# Altium schematic sheet Sheet_3.3v_2020-09-13_15-20-00.schdoc
size 351 x 253 mm
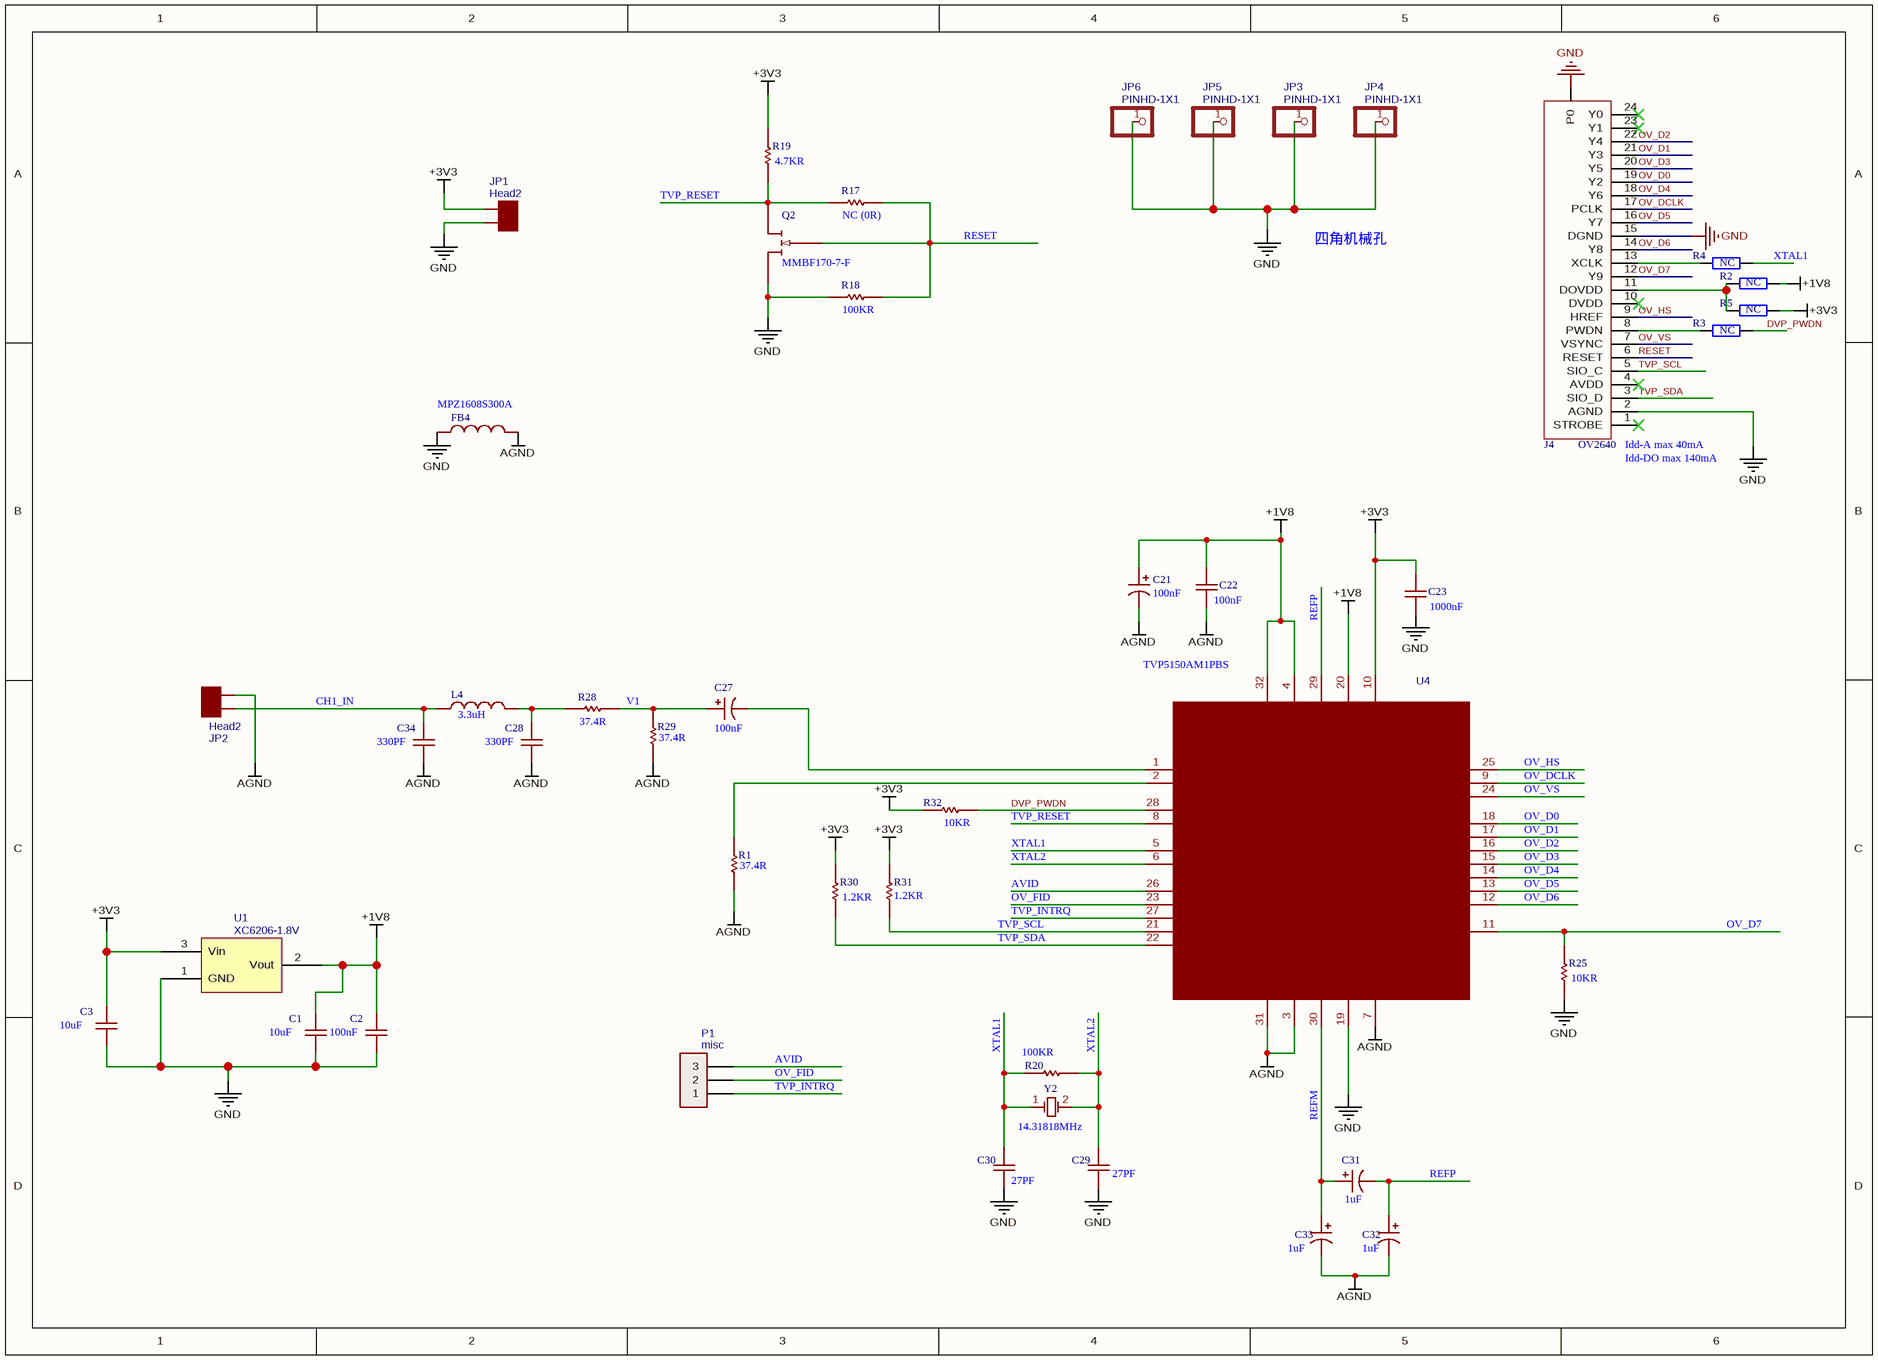
[diagram p0: Sheet_3.3v_2020-09-13_15-20-00.schdoc]

## Parts
C1  10uF  [C0805]  (value not drawn)
C2  330PF  [C0603]  (value not drawn)
C3  330PF  [C0805]  (value not drawn)
C21  100nF  [C0603]  (value not drawn)
C22  100nF  [C0603]  (value not drawn)
C23  1000nF  [C0603]  (value not drawn)
C27  100nF  [C0603]  (value not drawn)
C28  330PF  [C0603]  (value not drawn)
C29  27PF  [C0603]  (value not drawn)
C30  27PF  [C0603]  (value not drawn)
C31  1uF  [C0603]  (value not drawn)
C32  1uF  [C0603]  (value not drawn)
C33  1uF  [C0603]  (value not drawn)
C34  330PF  [C0603]  (value not drawn)
FB4  MPZ1608S300A  [L0805]  (value not drawn)
J4  OV2640  [FFC/SM0.5-2H24-OV5640]
JP1  Head2  [HEAD2]
JP2  Head2  [HEAD2]
JP3  PINHD-1X1  [HOLE]
JP4  PINHD-1X1  [HOLE]
JP5  PINHD-1X1  [HOLE]
JP6  PINHD-1X1  [HOLE]
L4  3.3uH  [L0805]  (value not drawn)
P1  misc  [1X3 PIN HEADER 2.54MM]
Q2  MMBF170-7-F  [SOT-23-3]  (value not drawn)
R1  37.4R  [R0603]  (value not drawn)
R2  NC  [R0603]
R3  NC  [R0603]
R4  NC  [R0603]
R5  NC  [R0603]
R17  NC (0R)  [R0603]  (value not drawn)
R18  100KR  [R0603]  (value not drawn)
R19  4.7KR  [R0603]  (value not drawn)
R20  100KR  [R0603]  (value not drawn)
R25  10KR  [R0603]  (value not drawn)
R28  37.4R  [R0603]  (value not drawn)
R29  37.4R  [R0603]  (value not drawn)
R30  1.2KR  [R0603]  (value not drawn)
R31  1.2KR  [R0603]  (value not drawn)
R32  10KR  [R0603]  (value not drawn)
U1  XC6206-1.8V  [SOT-23-3]
U4  TVP5150  [PBS32]  (value not drawn)
Y2  14.31818MHz  [晶振]  (value not drawn)

## Nets
+1V8: C1.2 C2.2 C21.1 C22.1 R2.2 U1.2(Vout) U4.4(PLL_AVDD) U4.20(DVDD) U4.32(CH_AVDD)
+3V3: C3.2 C23.1 JP1.1 R5.2 R19.1 R30.1 R31.1 R32.2 U1.3(Vin) U4.10(IO_DVDD)
AGND: C21.2 C22.2 C28.1 C32.2 C33.2 C34.1 FB4.2 JP2.1 R1.2 R29.2 U4.3(PLL_AGND) U4.7(AGND) U4.31(CH_AGND)
GND: C1.1 C2.1 C3.1 C23.2 C29.1 C30.1 FB4.1 J4.2(AGND) J4.15(DGND) J4.P0 JP1.2 JP3.1 JP4.1 JP5.1 JP6.1 Q2.2(S) R18.1 R25.2 U1.1(GND) U4.19(DGND)
AVID: P1.3 U4.26(AVID)
CH1_IN: C34.2 JP2.2 L4.1
DVP_PWDN: R3.2 R32.1 U4.28(PDN)
OV_D0: J4.19(Y2) U4.18(YOUT0)
OV_D1: J4.21(Y3) U4.17(YOUT1)
OV_D2: J4.22(Y4) U4.16(YOUT2)
OV_D3: J4.20(Y5) U4.15(YOUT3)
OV_D4: J4.18(Y6) U4.14(YOUT4)
OV_D5: J4.16(Y7) U4.13(YOUT5)
OV_D6: J4.14(Y8) U4.12(YOUT6)
OV_D7: J4.12(Y9) R25.1 U4.11(YOUT7/I2CSEL)
OV_DCLK: J4.17(PCLK) U4.9(PCLK/SCLK)
OV_FID: P1.2 U4.23(FID/GLCO)
OV_HS: J4.9(HREF) U4.25(HSYNC)
OV_VS: J4.7(VSYNC) U4.24(VSYNC/PALI)
REFM: C31.1 C33.1 U4.30(REFM)
REFP: C31.2 C32.1 U4.29(REFP)
RESET: J4.6(RESET) Q2.1(G) R17.2 R18.2
TVP_INTRQ: P1.1 U4.27(INTREQ/GPCL/VBLK)
TVP_RESET: Q2.3(D) R17.1 R19.2 U4.8(RESETB)
TVP_SCL: J4.5(SIO_C) R31.2 U4.21(SCL)
TVP_SDA: J4.3(SIO_D) R30.2 U4.22(SDA)
V1: C27.1 R28.2 R29.1
XTAL1: C30.2 R4.2 R20.2 U4.5(XTAL1/OSC) Y2.1(OSC1)
XTAL2: C29.2 R20.1 U4.6(XTAL2) Y2.2(OSC2)
NetC27_2: C27.2 U4.1(AIP1A)
NetC28_2: C28.2 L4.2 R28.1
NetJ4_8: J4.8(PWDN) R3.1
NetJ4_11: J4.11(DOVDD) R2.1 R5.1
NetJ4_13: J4.13(XCLK) R4.1
NetR1_1: R1.1 U4.2(AIP1B)

Not connected (* = marked no-connect by the designer): J4 1(STROBE)* 4(AVDD)* 10(DVDD)* 23(Y1)* 24(Y0)*

## Notes on the sheet
- 四角机械孔
- (near J4) Idd-DO max 140mA
- (near J4) Idd-A max 40mA
- (in symbol 330PF) 100nF; 10uF

## Library data of the parts
C1 = 10uF: PartNumber: 330PF; Current Footprint: 0805 (2012 Metric); Package Display: No; Published: 8-Jun-2000; LatestRevisionDate: 17-Jul-2002; LatestRevisionNote: Re-released for DXP Platform.; PackageReference: RAD-0.3; Publisher: Altium Limited; Part Number: 330PF
C2 C3 C28 C34 = 330PF: Current Footprint: 0805 (2012 Metric); Published: 8-Jun-2000; LatestRevisionDate: 17-Jul-2002; LatestRevisionNote: Re-released for DXP Platform.; PackageReference: RAD-0.3; Publisher: Altium Limited; PartNumber: 330PF; Part Number: 330PF
C21 C27 = 100nF: Manufacturer: Vishay or AVX Corporation; Current Footprint: 1206 (3216 Metric); Assembly Status: A; Published: 8-Jun-2000; LatestRevisionDate: 17-Jul-2002; LatestRevisionNote: Re-released for DXP Platform.; PackageReference: RB7.6-15; Publisher: Altium Limited; PartNumber: 100nF; Part Number: 100nF
C22 = 100nF: Current Footprint: 0805 (2012 Metric); Published: 8-Jun-2000; LatestRevisionDate: 17-Jul-2002; LatestRevisionNote: Re-released for DXP Platform.; PackageReference: RAD-0.3; Publisher: Altium Limited; PartNumber: 100nF; Part Number: 100nF
C23 = 1000nF: Current Footprint: 0805 (2012 Metric); Published: 8-Jun-2000; LatestRevisionDate: 17-Jul-2002; LatestRevisionNote: Re-released for DXP Platform.; PackageReference: RAD-0.3; Publisher: Altium Limited; PartNumber: 1000nF; Part Number: 1000nF
C29 C30 = 27PF: Current Footprint: 0805 (2012 Metric); Published: 8-Jun-2000; LatestRevisionDate: 17-Jul-2002; LatestRevisionNote: Re-released for DXP Platform.; PackageReference: RAD-0.3; Publisher: Altium Limited; PartNumber: 27PF; Part Number: 27PF
C31 = 1uF: Manufacturer: Vishay or AVX Corporation; Current Footprint: 1206 (3216 Metric); Assembly Status: A; Package Display: No; Published: 8-Jun-2000; LatestRevisionDate: 17-Jul-2002; LatestRevisionNote: Re-released for DXP Platform.; PackageReference: RB7.6-15; Publisher: Altium Limited; PartNumber: 1uF; Part Number: 1uF
C32 C33 = 1uF: Manufacturer: Vishay or AVX Corporation; Current Footprint: 1206 (3216 Metric); Assembly Status: A; Published: 8-Jun-2000; LatestRevisionDate: 17-Jul-2002; LatestRevisionNote: Re-released for DXP Platform.; PackageReference: RB7.6-15; Publisher: Altium Limited; PartNumber: 1uF; Part Number: 1uF
FB4 = MPZ1608S300A: Manufacturer Part Number: MPZ1608S300ATAH0; Code_IEC: 1005; Current Footprint: 0805 (2012 Metric); Assembly Status: A; Description: FERRITE BEAD 30 OHM 0603 1LN; Filter Type: Power Line; Number of Lines: 1; Impedance @ Frequency: 30 Ohm @ 100MHz; Current Rating (Max): 5A; DC Resistance (DCR) (Max): 10 mOhm; Published: 8-Jun-2000; LatestRevisionDate: 17-Jul-2002; LatestRevisionNote: Re-released for DXP Platform.; PackageReference: 0402-A; Publisher: Altium Limited; Code_JEITA: 0402; Manufacturer: *; PartNumber: MPZ1608S300A; Supplier 1: Digi-Key; Supplier Part Number 1: 445-1562-2-ND; RoHS: RoHS Compliant; Category: Filters; Stock 1: 76000; Pricing 1: 4000=0.0208, 8000=0.01885, 12000=0.0182, 28000=0.0169, 100000=0.01671 (USD); Packaging: Tape & Reel (TR); Part Status: Active; Ratings: -; Operating Temperature: -55�C  125�C; Package / Case: 0603 (1608 Metric); Mounting Type: Surface Mount; Height (Max): 0.030" (0.75mm); Size / Dimension: 0.063" L x 0.031" W (1.60mm x 0.80mm); ComponentLink1URL: https://product.tdk.com/info/en/catalog/datasheets/beads_commercial_power_mpz1608_en.pdf; ComponentLink1Description: https://product.tdk.com/info/en/catalog/datasheets/beads_commercial_power_mpz1608_en.pdf; Part Number: MPZ1608S300A
JP1 JP2 = Head2: Contributor: 395253A; spicePre: J; spiceSymbolName: Head2
JP3-JP6 = PINHD-1X1: Contributor: Adafruit; spicePre: J; spiceSymbolName: PINHD-1X1
L4 = 3.3uH: Code_IEC: 1005; Current Footprint: 0805 (2012 Metric); Assembly Status: A; Published: 8-Jun-2000; LatestRevisionDate: 17-Jul-2002; LatestRevisionNote: Re-released for DXP Platform.; PackageReference: 0402-A; Publisher: Altium Limited; Code_JEITA: 0402; Manufacturer: *; PartNumber: 3.3uH; Part Number: 3.3uH
P1 = misc: BOM_Manufacturer Part: Female header/2.54mm2x3 Female header; spicePre: P; spiceSymbolName: Header-Female-2.54_1x3
Q2 = MMBF170-7-F: Manufacturer: Diodes Incorporated; FET Type: N-Channel; Rds On (Max) @ Id, Vgs: 5 Ohm @ 200mA, 10V; Input Capacitance (Ciss) @ Vds: 40pF @ 10V; Drain to Source Voltage (Vdss): 60V; Power Dissipation (Max): 300mW (Ta); Vgs(th) (Max) @ Id: 3V @ 250�A; Current - Continuous Drain (Id) @ 25�C: 500mA (Ta); Package Display: No; Mounting Type: Surface Mount; Manufacturer Part Number: MMBF170-7-F; Gate Charge (Qg) @ Vgs: -; RoHS: RoHS Compliant; Category: Discrete Semiconductor Products; Operating Temperature: -55�C  150�C (TJ); FET Feature: -; Supplier: Digi-Key; Part Status: Active; Packaging: Tape & Reel (TR); Technology: MOSFET (Metal Oxide); Supplier Part Number: MMBF170-FDITR-ND; Supplier Device Package: SOT-23-3; Package / Case: TO-236-3, SC-59, SOT-23-3; PartNumber: MMBF170-7-F; Pricing: 3000=0.06325, 6000=0.055, 15000=0.04675, 30000=0.044, 75000=0.04125, 150000=0.03575 (USD); HelpURL: C:\Users\MEHDI-PC\Desktop\Docs\ds30104.pdf; Stock: 30000; Part Number: MMBF170-7-F; Current Footprint: SOT-23-3
R1 R28 R29 = 37.4R: Current Footprint: 0805 (2012 Metric); Published: 8-Jun-2000; LatestRevisionDate: 17-Jul-2002; LatestRevisionNote: Re-released for DXP Platform.; PackageReference: AXIAL-0.3; Publisher: Altium Limited; PartNumber: 37.4R; Part Number: 37.4R
R17 = NC (0R): Current Footprint: 0805 (2012 Metric); Published: 8-Jun-2000; LatestRevisionDate: 17-Jul-2002; LatestRevisionNote: Re-released for DXP Platform.; PackageReference: AXIAL-0.3; Publisher: Altium Limited; PartNumber: NC (0R); Part Number: NC (0R)
R18 R20 = 100KR: Current Footprint: 0805 (2012 Metric); Published: 8-Jun-2000; LatestRevisionDate: 17-Jul-2002; LatestRevisionNote: Re-released for DXP Platform.; PackageReference: AXIAL-0.3; Publisher: Altium Limited; PartNumber: 100KR; Part Number: 100KR
R19 = 4.7KR: Current Footprint: 0805 (2012 Metric); Published: 8-Jun-2000; LatestRevisionDate: 17-Jul-2002; LatestRevisionNote: Re-released for DXP Platform.; PackageReference: AXIAL-0.3; Publisher: Altium Limited; PartNumber: 4.7KR; Part Number: 4.7KR
R25 R32 = 10KR: Current Footprint: 0805 (2012 Metric); Published: 8-Jun-2000; LatestRevisionDate: 17-Jul-2002; LatestRevisionNote: Re-released for DXP Platform.; PackageReference: AXIAL-0.3; Publisher: Altium Limited; PartNumber: 10KR; Part Number: 10KR
R30 R31 = 1.2KR: Current Footprint: 0805 (2012 Metric); Published: 8-Jun-2000; LatestRevisionDate: 17-Jul-2002; LatestRevisionNote: Re-released for DXP Platform.; PackageReference: AXIAL-0.3; Publisher: Altium Limited; PartNumber: 1.2KR; Part Number: 1.2KR
U1 = XC6206-1.8V: Contributor: JesseRock; spicePre: U; spiceSymbolName: XC6206
U4 = TVP5150: PartNumber: TVP5150AM1PBS; Package Display: No; Published: 6-Oct-2005; LatestRevisionDate: 13-Apr-2006; LatestRevisionNote: IPC-7351 Footprint Added.; DatasheetVersion: May-2004; PackageVersion: Nov-1995; PackageReference: PBS32; Publisher: Altium Limited; PackageDescription: 32-Pin Thin Plastic Quad Flat Pack 0.5 mm Pitch; Code_JEDEC: MS-026-AAA; ComponentLink1Description: Manufacturer Link; ComponentLink1URL: http://focus.ti.com/docs/prod/folders/print/tvp5150am1.html; ComponentLink2Description: Datasheet; ComponentLink2URL: http://focus.ti.com/lit/ds/symlink/tvp5150am1.pdf; HelpURL: C:\Users\MEHDI-PC\Desktop\Docs\tvp5150am1.pdf; Part Number: TVP5150AM1PBS; Current Footprint: PBS32
Y2 = 14.31818MHz: Manufacturer: TXC CORPORATION; Current Footprint: XTAL_S; Assembly Status: A; Package Display: No; Published: 8-Jun-2000; LatestRevisionDate: 17-Jul-2002; LatestRevisionNote: Re-released for DXP Platform.; PackageReference: R38; Publisher: Altium Limited; Supplier 1: Digi-Key; Supplier Part Number 1: CTX908-ND; PartNumber: 14.31818MHz; Part Number: 14.31818MHz
J4 = OV2640: LatestRevisionDate: 17-Jul-2002; LatestRevisionNote: Re-released for DXP Platform.; Publisher: Altium Limited